# EAGLE design kurskTovideroRaspi (EAGLE 9.5.2)

## Sheet 1 of 4
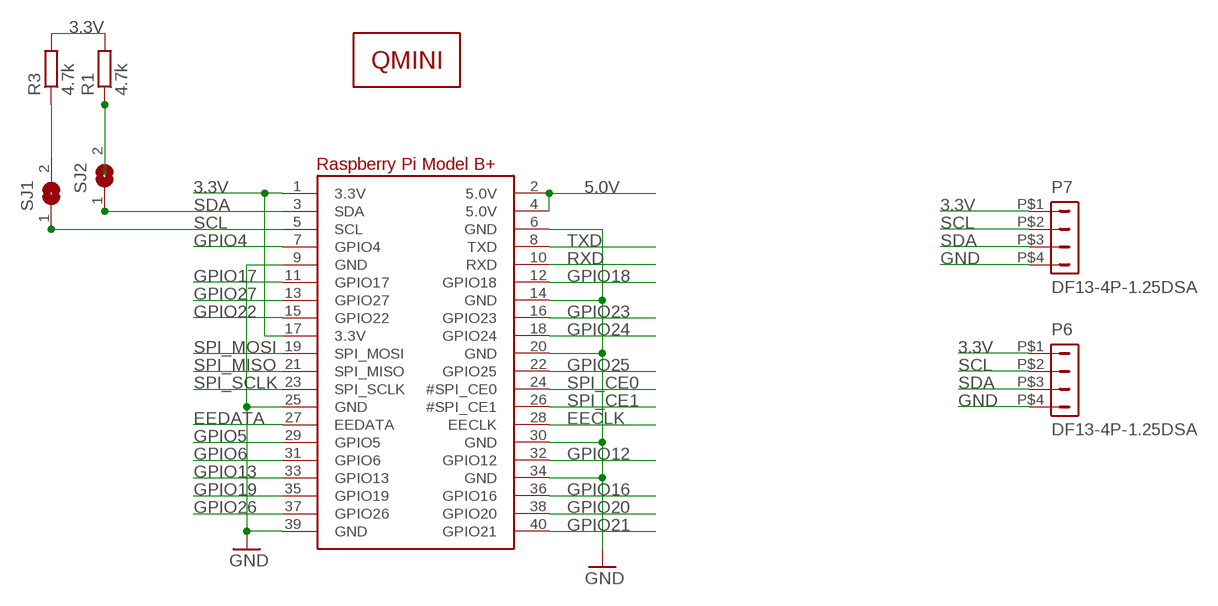
[diagram p0: schematic, sheet 1]

### Parts
P6  DF13-4P-1.25DSA  [DF13-4P-1.25DSA]
P7  DF13-4P-1.25DSA  [DF13-4P-1.25DSA]
R1  4.7k  R-EU_R0805  [R0805]
R3  4.7k  R-EU_R0805  [R0805]
RPI1  RASPBERRYPI_BPLUS_HATNOSLOTS  [PI_HAT_NOSLOTS]
SJ1  SJ  [SJ]
SJ2  SJ  [SJ]
U$1  QMINI  [QMINI]

### Nets
3.3V: P6.P$1 P7.P$1 R1.2 R3.2 RPI1.1(3.3V) RPI1.17(3.3V) ; also sheet 3,4
5.0V: RPI1.2(5.0V) RPI1.4(5.0V) ; also sheet 2
EECLK: RPI1.28(EECLK)
EEDATA: RPI1.27(EEDATA)
GND: P6.P$4 P7.P$4 RPI1.6(GND) RPI1.9(GND) RPI1.14(GND) RPI1.20(GND) RPI1.25(GND) RPI1.30(GND) RPI1.34(GND) RPI1.39(GND) ; also sheet 2,3,4
GPIO4: RPI1.7(GPIO4)
GPIO5: RPI1.29(GPIO5)
GPIO6: RPI1.31(GPIO6)
GPIO12: RPI1.32(GPIO12)
GPIO13: RPI1.33(GPIO13)
GPIO16: RPI1.36(GPIO16)
GPIO17: RPI1.11(GPIO17) ; also sheet 2
GPIO18: RPI1.12(GPIO18)
GPIO19: RPI1.35(GPIO19)
GPIO20: RPI1.38(GPIO20)
GPIO21: RPI1.40(GPIO21)
GPIO22: RPI1.15(GPIO22) ; also sheet 2
GPIO23: RPI1.16(GPIO23)
GPIO24: RPI1.18(GPIO24)
GPIO25: RPI1.22(GPIO25)
GPIO26: RPI1.37(GPIO26)
GPIO27: RPI1.13(GPIO27) ; also sheet 2
N$1: R3.1 SJ1.2
N$7: R1.1 SJ2.2
RXD: RPI1.10(RXD)
SCL: P6.P$2 P7.P$2 RPI1.5(SCL) SJ1.1 ; also sheet 3,4
SDA: P6.P$3 P7.P$3 RPI1.3(SDA) SJ2.1 ; also sheet 3,4
SPI_CE0: RPI1.24(#SPI_CE0)
SPI_CE1: RPI1.26(#SPI_CE1)
SPI_MISO: RPI1.21(SPI_MISO)
SPI_MOSI: RPI1.19(SPI_MOSI)
SPI_SCLK: RPI1.23(SPI_SCLK)
TXD: RPI1.8(TXD)

## Sheet 2 of 4
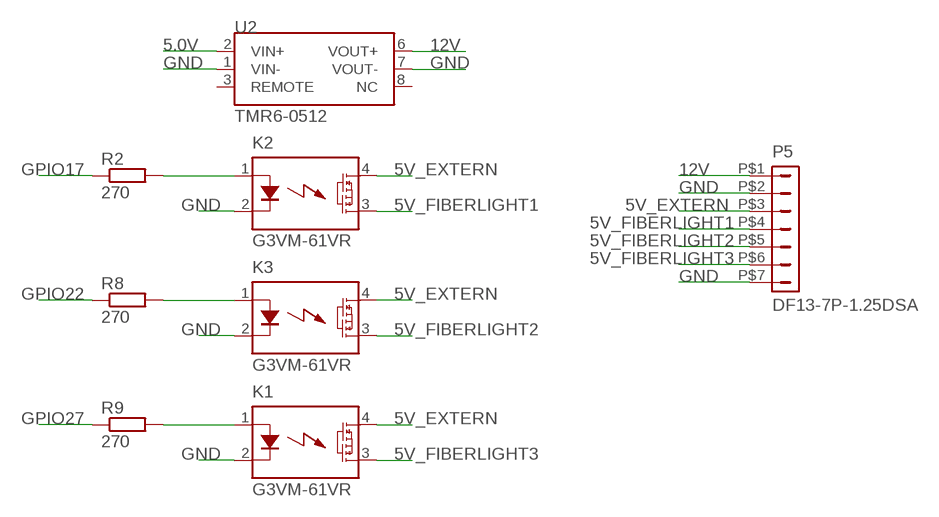
[diagram p1: schematic, sheet 2]

### Parts
K1  G3VM-61VR  AQY22SOP  [SOP04]
K2  G3VM-61VR  AQY22SOP  [SOP04]
K3  G3VM-61VR  AQY22SOP  [SOP04]
P5  DF13-7P-1.25DSA  [DF13-7P-1.25DSA]
R2  270  R-EU_R0805  [R0805]
R8  270  R-EU_R0805  [R0805]
R9  270  R-EU_R0805  [R0805]
U2  TMR6-0512  [TMR6-0512]

### Nets
5.0V: U2.2(VIN+) ; also sheet 1
5V_EXTERN: K1.4(DS1) K2.4(DS1) K3.4(DS1) P5.P$3
5V_FIBERLIGHT1: K2.3(DS2) P5.P$4
5V_FIBERLIGHT2: K3.3(DS2) P5.P$5
5V_FIBERLIGHT3: K1.3(DS2) P5.P$6
12V: P5.P$1 U2.6(VOUT+)
GND: K1.2(K) K2.2(K) K3.2(K) P5.P$2 P5.P$7 U2.1(VIN-) U2.7(VOUT-) ; also sheet 1,3,4
GPIO17: R2.1 ; also sheet 1
GPIO22: R8.1 ; also sheet 1
GPIO27: R9.1 ; also sheet 1
N$2: K1.1(A) R9.2
N$3: K2.1(A) R2.2
N$9: K3.1(A) R8.2
Unconnected: U2.3(REMOTE) U2.8(NC)

## Sheet 3 of 4
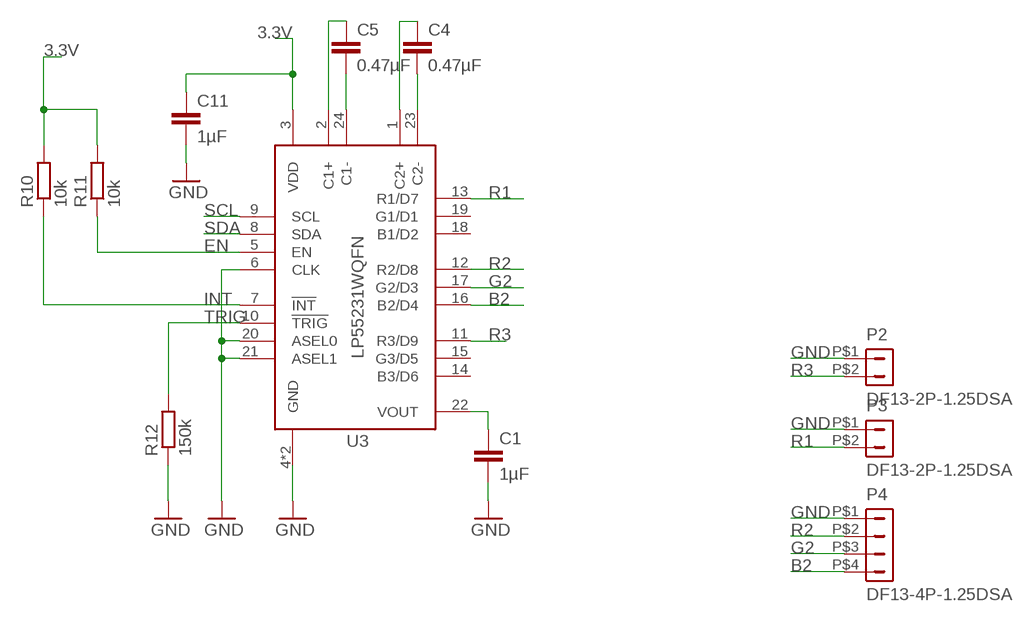
[diagram p2: schematic, sheet 3]

### Parts
C1  1µF  C-EUC0805  [C0805]
C4  0.47µF  C-EUC0805  [C0805]
C5  0.47µF  C-EUC0805  [C0805]
C11  1µF  C-EUC0805  [C0805]
P2  DF13-2P-1.25DSA  [DF13-2P-1.25DSA]
P3  DF13-2P-1.25DSA  [DF13-2P-1.25DSA]
P4  DF13-4P-1.25DSA  [DF13-4P-1.25DSA]
R10  10k  R-EU_R0805  [R0805]
R11  10k  R-EU_R0805  [R0805]
R12  150k  R-EU_R0805  [R0805]
U3  LP55231WQFN  [WQFN-24]

### Nets
3.3V: C11.1 R10.2 R11.2 U3.3(VDD) ; also sheet 1,4
B2: P4.P$4 U3.16(B2/D4)
EN: R11.1 U3.5(EN)
G2: P4.P$3 U3.17(G2/D3)
GND: C1.2 C11.2 P2.P$1 P3.P$1 P4.P$1 R12.1 U3.4(GND) U3.6(CLK) U3.20(ASEL0) U3.21(ASEL1) U3.EP(GND) ; also sheet 1,2,4
INT: R10.1 U3.7(!INT)
N$4: C5.2 U3.24(C1-)
N$5: C4.2 U3.23(C2-)
N$6: C4.1 U3.1(C2+)
N$11: C5.1 U3.2(C1+)
R1: P3.P$2 U3.13(R1/D7)
R2: P4.P$2 U3.12(R2/D8)
R3: P2.P$2 U3.11(R3/D9)
SCL: U3.9(SCL) ; also sheet 1,4
SDA: U3.8(SDA) ; also sheet 1,4
TRIG: R12.2 U3.10(!TRIG)
VOUT: C1.1 U3.22(VOUT)
Unconnected: U3.14(B3/D6) U3.15(G3/D5) U3.18(B1/D2) U3.19(G1/D1)

## Sheet 4 of 4
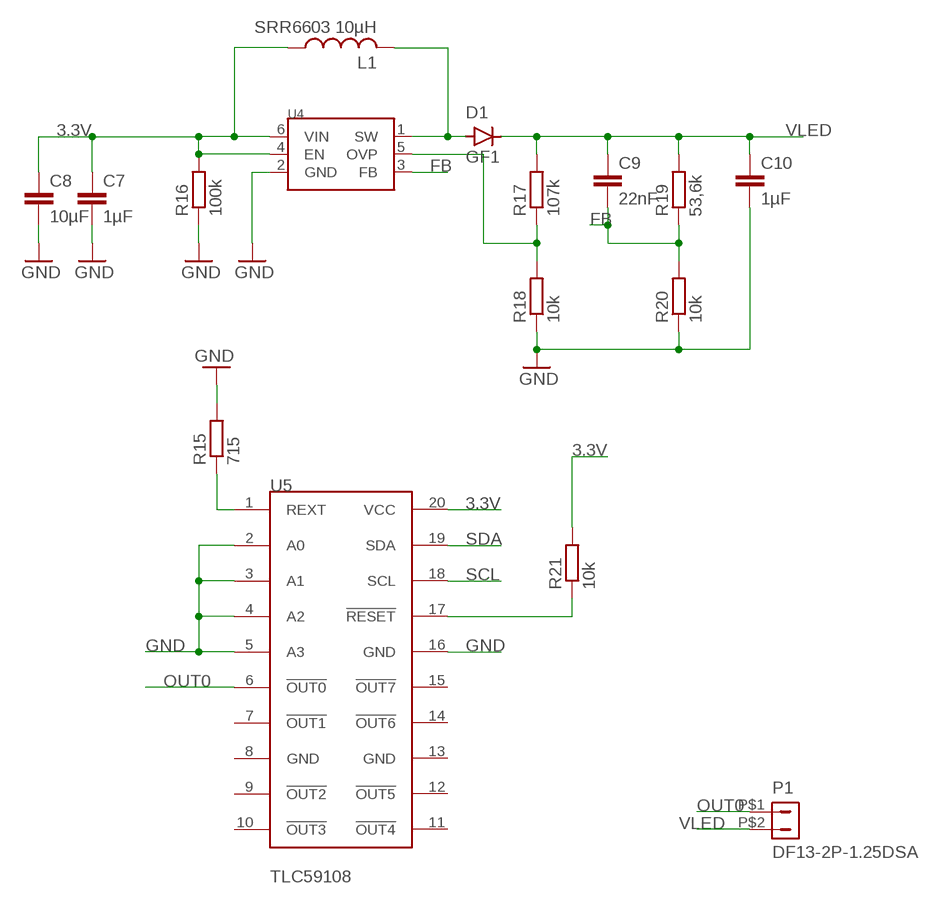
[diagram p3: schematic, sheet 4]

### Parts
C7  1µF  C-EUC0805  [C0805]
C8  10µF  C-EUC0805  [C0805]
C9  22nF  C-EUC0805  [C0805]
C10  1µF  C-EUC0805  [C0805]
D1  GF1  [SMA-DO214AC]
L1  SRR6603 10µH  SRR6603  [SRR6603]
P1  DF13-2P-1.25DSA  [DF13-2P-1.25DSA]
R15  715  R-EU_R0805  [R0805]
R16  100k  R-EU_R0805  [R0805]
R17  107k  R-EU_R0805  [R0805]
R18  10k  R-EU_R0805  [R0805]
R19  53,6k  R-EU_R0805  [R0805]
R20  10k  R-EU_R0805  [R0805]
R21  10k  R-EU_R0805  [R0805]
U4  MIC2619  [SOT-23-6]
U5  TLC59108  [TSSOP20]

### Nets
3.3V: C7.1 C8.1 L1.1 R16.2 R21.2 U4.4(EN) U4.6(VIN) U5.20(VCC) ; also sheet 1,3
FB: C9.2 R19.1 R20.2 U4.3(FB)
GND: C7.2 C8.2 C10.2 R15.2 R16.1 R18.1 R20.1 U4.2(GND) U5.2(A0) U5.3(A1) U5.4(A2) U5.5(A3) U5.16(GND) ; also sheet 1,2,3
N$13: R15.1 U5.1(REXT)
N$15: D1.A L1.2 U4.1(SW)
N$16: R17.1 R18.2 U4.5(OVP)
N$17: R21.1 U5.17(!RESET)
OUT0: P1.P$1 U5.6(!OUT0)
SCL: U5.18(SCL) ; also sheet 1,3
SDA: U5.19(SDA) ; also sheet 1,3
VLED: C9.1 C10.1 D1.K(C) P1.P$2 R17.2 R19.2
Unconnected: U5.7(!OUT1) U5.8(GND) U5.9(!OUT2) U5.10(!OUT3) U5.11(!OUT4) U5.12(!OUT5) U5.13(GND) U5.14(!OUT6) U5.15(!OUT7)

## Library data of the parts
C1 C7 C10 C11 = rcl:C-EU: CAPACITOR, European symbol; CLASS: CAPACITOR; DESCRIPTION: NO DESCRIPTION; DIGIKEY: 311-1458-1-ND; LINK: UNKNOWN LINK; MANUFACTURER: UNKNOWN MANUFACTURER; MANUFACTURERPARTNUMBER: UNKNOWN MANUFACTURER PART NUMBER; MF: AVX; MPN: 08053C105JAT2A; OC_FARNELL: 2332736; POPULATED: TRUE; ROHSCERTIFICATE: UNKNOWN ROHS CERTIFICATE; SOURCE: UNKNOWN SOURCE; SOURCEPARTNUMBER: UNKNOWN SOURCE PART NUMBER; SPICEPREFIX: C
C4 C5 = rcl:C-EU: CAPACITOR, European symbol; CLASS: CAPACITOR; DESCRIPTION: NO DESCRIPTION; DIGIKEY: 399-9247-1-ND; LINK: UNKNOWN LINK; MANUFACTURER: UNKNOWN MANUFACTURER; MANUFACTURERPARTNUMBER: UNKNOWN MANUFACTURER PART NUMBER; MF: VISHAY; MPN: VJ0805Y474JXQTW1BC; OC_FARNELL: 2896589; POPULATED: TRUE; ROHSCERTIFICATE: UNKNOWN ROHS CERTIFICATE; SOURCE: UNKNOWN SOURCE; SOURCEPARTNUMBER: UNKNOWN SOURCE PART NUMBER; SPICEPREFIX: C
C8 = rcl:C-EU: CAPACITOR, European symbol; CLASS: CAPACITOR; DESCRIPTION: NO DESCRIPTION; DIGIKEY: 399-4925-1-ND; LINK: UNKNOWN LINK; MANUFACTURER: UNKNOWN MANUFACTURER; MANUFACTURERPARTNUMBER: UNKNOWN MANUFACTURER PART NUMBER; MF: KEMET; MPN: C0805C106K8RACTU; OC_FARNELL: 2118132; POPULATED: TRUE; ROHSCERTIFICATE: UNKNOWN ROHS CERTIFICATE; SOURCE: UNKNOWN SOURCE; SOURCEPARTNUMBER: UNKNOWN SOURCE PART NUMBER; SPICEPREFIX: C
C9 = rcl:C-EU: CAPACITOR, European symbol; CLASS: CAPACITOR; DESCRIPTION: NO DESCRIPTION; DIGIKEY: 732-8023-1-ND; LINK: UNKNOWN LINK; MANUFACTURER: UNKNOWN MANUFACTURER; MANUFACTURERPARTNUMBER: UNKNOWN MANUFACTURER PART NUMBER; MF: AVX; MPN: 08055C223KAZ2A; OC_FARNELL: 1740538; POPULATED: TRUE; ROHSCERTIFICATE: UNKNOWN ROHS CERTIFICATE; SOURCE: UNKNOWN SOURCE; SOURCEPARTNUMBER: UNKNOWN SOURCE PART NUMBER; SPICEPREFIX: C
D1 = diode:GF1: DIODE; CLASS: DIODE; DESCRIPTION: NO DESCRIPTION; DIGIKEY: EGF1D-E3/67AGICT-ND; LINK: UNKNOWN LINK; MANUFACTURER: UNKNOWN MANUFACTURER; MANUFACTURERPARTNUMBER: UNKNOWN MANUFACTURER PART NUMBER; MF: VISHAY; MPN: EGF1D-E3/67A; OC_FARNELL: 1836975; POPULATED: TRUE; ROHSCERTIFICATE: UNKNOWN ROHS CERTIFICATE; SOURCE: UNKNOWN SOURCE; SOURCEPARTNUMBER: UNKNOWN SOURCE PART NUMBER
K1-K3 = relay:AQY*: PhotoMOS Relay NAiS Source: http://www.panasonic-electric-works.com/catalogues/downloads/photomos/ds_x615_en_aqz10_20.pdf; CLASS: RELAY; DESCRIPTION: NO DESCRIPTION; DIGIKEY: Z10319CT-ND; LINK: UNKNOWN LINK; MANUFACTURER: UNKNOWN MANUFACTURER; MANUFACTURERPARTNUMBER: UNKNOWN MANUFACTURER PART NUMBER; MF: OMRON; MPN: G3VM-61VR(TR05); OC_FARNELL: 2889501; OC_NEWARK: unknown; POPULATED: TRUE; ROHSCERTIFICATE: UNKNOWN ROHS CERTIFICATE; SOURCE: UNKNOWN SOURCE; SOURCEPARTNUMBER: UNKNOWN SOURCE PART NUMBER
L1 = detector:SRR6603; CLASS: INDUCTOR; DESCRIPTION: NO DESCRIPTION; DIGIKEY: SRR6603-100MLCT-ND; LINK: UNKNOWN LINK; MANUFACTURER: UNKNOWN MANUFACTURER; MANUFACTURERPARTNUMBER: UNKNOWN MANUFACTURER PART NUMBER; MF: BOURNS; MPN: SRR6603-100ML; OC_FARNELL: 2333822; POPULATED: TRUE; ROHSCERTIFICATE: UNKNOWN ROHS CERTIFICATE; SOURCE: UNKNOWN SOURCE; SOURCEPARTNUMBER: UNKNOWN SOURCE PART NUMBER
P1-P3 = con-hirose-df13:DF13-2P-1.25: DF13-2P 1.25mm Pitch Miniature Crimping Connector.; CLASS: UNKNOWN CLASS; DESCRIPTION: NO DESCRIPTION; DIGIKEY: H2191-ND; LINK: UNKNOWN LINK; MANUFACTURER: UNKNOWN MANUFACTURER; MANUFACTURERPARTNUMBER: UNKNOWN MANUFACTURER PART NUMBER; MF: HIROSE(HRS); MPN: DF13-2P-1.25DSA; OC_FARNELL: 2427585; POPULATED: TRUE; ROHSCERTIFICATE: UNKNOWN ROHS CERTIFICATE; SOURCE: UNKNOWN SOURCE; SOURCEPARTNUMBER: UNKNOWN SOURCE PART NUMBER
P4 P6 = con-hirose-df13:DF13-4P-1.25: DF13-4P 1.25mm Pitch Miniature Crimping Connector.; CLASS: UNKNOWN CLASS; DESCRIPTION: NO DESCRIPTION; DIGIKEY: H2193-ND; LINK: UNKNOWN LINK; MANUFACTURER: UNKNOWN MANUFACTURER; MANUFACTURERPARTNUMBER: UNKNOWN MANUFACTURER PART NUMBER; MF: HIROSE(HRS); MPN: DF13-4P-1.25DSA; OC_FARNELL: 2427588; POPULATED: TRUE; ROHSCERTIFICATE: UNKNOWN ROHS CERTIFICATE; SOURCE: UNKNOWN SOURCE; SOURCEPARTNUMBER: UNKNOWN SOURCE PART NUMBER
P5 = con-hirose-df13:DF13-7P-1.25: DF13-7P 1.25mm Pitch Miniature Crimping Connector.; CLASS: UNKNOWN CLASS; DESCRIPTION: NO DESCRIPTION; DIGIKEY: H2196-ND; LINK: UNKNOWN LINK; MANUFACTURER: UNKNOWN MANUFACTURER; MANUFACTURERPARTNUMBER: UNKNOWN MANUFACTURER PART NUMBER; MF: HIROSE(HRS); MPN: DF13A-7P-1.25H(21); OC_FARNELL: 3019730; POPULATED: TRUE; ROHSCERTIFICATE: UNKNOWN ROHS CERTIFICATE; SOURCE: UNKNOWN SOURCE; SOURCEPARTNUMBER: UNKNOWN SOURCE PART NUMBER
P7 = con-hirose-df13:DF13-4P-1.25: DF13-4P 1.25mm Pitch Miniature Crimping Connector.; CLASS: UNKNOWN CLASS; DESCRIPTION: NO DESCRIPTION; DIGIKEY#: H2193-ND; LINK: UNKNOWN LINK; MANUFACTURER: UNKNOWN MANUFACTURER; MANUFACTURERPARTNUMBER: UNKNOWN MANUFACTURER PART NUMBER; MF: HIROSE(HRS); MPN: DF13-4P-1.25DSA; OC_FARNELL: 2427588; POPULATED: TRUE; ROHSCERTIFICATE: UNKNOWN ROHS CERTIFICATE; SOURCE: UNKNOWN SOURCE; SOURCEPARTNUMBER: UNKNOWN SOURCE PART NUMBER
R1 R3 = rcl:R-EU_: RESISTOR, European symbol; CLASS: RESISTOR; DESCRIPTION: NO DESCRIPTION; DIGIKEY: 541-4.70KCCT-ND; LINK: UNKNOWN LINK; MANUFACTURER: UNKNOWN MANUFACTURER; MANUFACTURERPARTNUMBER: UNKNOWN MANUFACTURER PART NUMBER; MF: YAGEO; MPN: RE0805DR-074K7L; OC_FARNELL: 1840620; POPULATED: TRUE; ROHSCERTIFICATE: UNKNOWN ROHS CERTIFICATE; SOURCE: UNKNOWN SOURCE; SOURCEPARTNUMBER: UNKNOWN SOURCE PART NUMBER; SPICEPREFIX: R
R2 R8 R9 = rcl:R-EU_: RESISTOR, European symbol; CLASS: RESISTOR; DESCRIPTION: NO DESCRIPTION; DIGIKEY: P270CCT-ND; LINK: UNKNOWN LINK; MANUFACTURER: UNKNOWN MANUFACTURER; MANUFACTURERPARTNUMBER: UNKNOWN MANUFACTURER PART NUMBER; MF: PANASONIC; MPN: ERA6AEB271V; OC_FARNELL: 1577650; POPULATED: TRUE; ROHSCERTIFICATE: UNKNOWN ROHS CERTIFICATE; SOURCE: UNKNOWN SOURCE; SOURCEPARTNUMBER: UNKNOWN SOURCE PART NUMBER; SPICEPREFIX: R
R10 R11 R18 R20 R21 = rcl:R-EU_: RESISTOR, European symbol; CLASS: RESISTOR; DESCRIPTION: NO DESCRIPTION; DIGIKEY: 311-10.0KCRCT-ND; LINK: UNKNOWN LINK; MANUFACTURER: UNKNOWN MANUFACTURER; MANUFACTURERPARTNUMBER: UNKNOWN MANUFACTURER PART NUMBER; OC_FARNELL: unknown; POPULATED: TRUE; ROHSCERTIFICATE: UNKNOWN ROHS CERTIFICATE; SOURCE: UNKNOWN SOURCE; SOURCEPARTNUMBER: UNKNOWN SOURCE PART NUMBER; SPICEPREFIX: R
R12 = rcl:R-EU_: RESISTOR, European symbol; CLASS: RESISTOR; DESCRIPTION: NO DESCRIPTION; DIGIKEY: P150KCCT-ND; LINK: UNKNOWN LINK; MANUFACTURER: UNKNOWN MANUFACTURER; MANUFACTURERPARTNUMBER: UNKNOWN MANUFACTURER PART NUMBER; MF: MULTICOMP PRO; MPN: MCWR08X1503FTL; OC_FARNELL: 2447573; POPULATED: TRUE; ROHSCERTIFICATE: UNKNOWN ROHS CERTIFICATE; SOURCE: UNKNOWN SOURCE; SOURCEPARTNUMBER: UNKNOWN SOURCE PART NUMBER; SPICEPREFIX: R
R15 = rcl:R-EU_: RESISTOR, European symbol; CLASS: RESISTOR; DESCRIPTION: NO DESCRIPTION; DIGIKEY: RMCF0805FT715RCT-ND; LINK: UNKNOWN LINK; MANUFACTURER: UNKNOWN MANUFACTURER; MANUFACTURERPARTNUMBER: UNKNOWN MANUFACTURER PART NUMBER; MF: PANASONIC; MPN: ERJ6ENF7150V; OC_FARNELL: 2303536; POPULATED: TRUE; ROHSCERTIFICATE: UNKNOWN ROHS CERTIFICATE; SOURCE: UNKNOWN SOURCE; SOURCEPARTNUMBER: UNKNOWN SOURCE PART NUMBER; SPICEPREFIX: R
R16 = rcl:R-EU_: RESISTOR, European symbol; CLASS: RESISTOR; DESCRIPTION: NO DESCRIPTION; DIGIKEY: 311-100KCRCT-ND; LINK: UNKNOWN LINK; MANUFACTURER: UNKNOWN MANUFACTURER; MANUFACTURERPARTNUMBER: UNKNOWN MANUFACTURER PART NUMBER; MF: PANASONIC; MPN: ERJT06J104V; OC_FARNELL: 1618243; POPULATED: TRUE; ROHSCERTIFICATE: UNKNOWN ROHS CERTIFICATE; SOURCE: UNKNOWN SOURCE; SOURCEPARTNUMBER: UNKNOWN SOURCE PART NUMBER; SPICEPREFIX: R
R17 = rcl:R-EU_: RESISTOR, European symbol; CLASS: RESISTOR; DESCRIPTION: NO DESCRIPTION; DIGIKEY: 541-107KCCT-ND; LINK: UNKNOWN LINK; MANUFACTURER: UNKNOWN MANUFACTURER; MANUFACTURERPARTNUMBER: UNKNOWN MANUFACTURER PART NUMBER; MF: VISHAY; MPN: CRCW0805107KFKEA; OC_FARNELL: 2316483; POPULATED: TRUE; ROHSCERTIFICATE: UNKNOWN ROHS CERTIFICATE; SOURCE: UNKNOWN SOURCE; SOURCEPARTNUMBER: UNKNOWN SOURCE PART NUMBER; SPICEPREFIX: R
R19 = rcl:R-EU_: RESISTOR, European symbol; CLASS: RESISTOR; DESCRIPTION: NO DESCRIPTION; DIGIKEY: P53.6KFCT-ND; LINK: UNKNOWN LINK; MANUFACTURER: UNKNOWN MANUFACTURER; MANUFACTURERPARTNUMBER: UNKNOWN MANUFACTURER PART NUMBER; MF: MULTICOMP PRO; MPN: MCWR08X5362FTL; OC_FARNELL: 2447683; POPULATED: TRUE; ROHSCERTIFICATE: UNKNOWN ROHS CERTIFICATE; SOURCE: UNKNOWN SOURCE; SOURCEPARTNUMBER: UNKNOWN SOURCE PART NUMBER; SPICEPREFIX: R
RPI1 = microbuilder:RASPBERRYPI_BPLUS; CLASS: RESISTOR; DESCRIPTION: NO DESCRIPTION; LINK: UNKNOWN LINK; MANUFACTURER: UNKNOWN MANUFACTURER; MANUFACTURERPARTNUMBER: UNKNOWN MANUFACTURER PART NUMBER; OC_FARNELL: unknown; POPULATED: TRUE; ROHSCERTIFICATE: UNKNOWN ROHS CERTIFICATE; SOURCE: UNKNOWN SOURCE; SOURCEPARTNUMBER: UNKNOWN SOURCE PART NUMBER
SJ1 SJ2 = jumper:SJ: SMD solder JUMPER; OC_FARNELL: unknown
U2 = dcdc:TMR6-0512; CLASS: IC; DESCRIPTION: NO DESCRIPTION; DIGIKEY: 1951-2391-ND; LINK: UNKNOWN LINK; MANUFACTURER: UNKNOWN MANUFACTURER; MANUFACTURERPARTNUMBER: UNKNOWN MANUFACTURER PART NUMBER; MF: TRACOPOWER; MPN: TMR 6-0512; OC_FARNELL: 2280181; POPULATED: TRUE; ROHSCERTIFICATE: UNKNOWN ROHS CERTIFICATE; SOURCE: UNKNOWN SOURCE; SOURCEPARTNUMBER: UNKNOWN SOURCE PART NUMBER
U3 = LP55231:LP55231; CLASS: IC; DESCRIPTION: NO DESCRIPTION; DIGIKEY: 296-40354-1-ND; LINK: UNKNOWN LINK; MANUFACTURER: UNKNOWN MANUFACTURER; MANUFACTURERPARTNUMBER: UNKNOWN MANUFACTURER PART NUMBER; MF: TEXAS INSTRUMENTS; MPN: LP55231SQE/NOPB; OC_FARNELL: 3006014; POPULATED: TRUE; PROD_ID: IC-13302; ROHSCERTIFICATE: UNKNOWN ROHS CERTIFICATE; SOURCE: UNKNOWN SOURCE; SOURCEPARTNUMBER: UNKNOWN SOURCE PART NUMBER
U4 = emitter:MIC2619; CLASS: IC; DESCRIPTION: NO DESCRIPTION; DIGIKEY: 576-3655-1-ND; LINK: UNKNOWN LINK; MANUFACTURER: UNKNOWN MANUFACTURER; MANUFACTURERPARTNUMBER: UNKNOWN MANUFACTURER PART NUMBER; MF: MICROCHIP; MPN: MIC2619YD6-TR; OC_FARNELL: 2509963; POPULATED: TRUE; ROHSCERTIFICATE: UNKNOWN ROHS CERTIFICATE; SOURCE: UNKNOWN SOURCE; SOURCEPARTNUMBER: UNKNOWN SOURCE PART NUMBER
U5 = emitter:TLC59108: 8-Bit Fast Mode Plus (FM+) I2C Bus Constant-Current LED Sink Driver; CLASS: IC; DESCRIPTION: NO DESCRIPTION; DIGIKEY: 296-25340-1-ND; LINK: UNKNOWN LINK; MANUFACTURER: UNKNOWN MANUFACTURER; MANUFACTURERPARTNUMBER: UNKNOWN MANUFACTURER PART NUMBER; MF: TEXAS INSTRUMENTS; MPN: TLC59108IPWR; OC_FARNELL: 3119168; POPULATED: TRUE; ROHSCERTIFICATE: UNKNOWN ROHS CERTIFICATE; SOURCE: UNKNOWN SOURCE; SOURCEPARTNUMBER: UNKNOWN SOURCE PART NUMBER
U$1 = Peripherie:QMINI; CLASS: IC; DESCRIPTION: NO DESCRIPTION; LINK: UNKNOWN LINK; MANUFACTURER: UNKNOWN MANUFACTURER; MANUFACTURERPARTNUMBER: UNKNOWN MANUFACTURER PART NUMBER; OC_FARNELL: unknown; POPULATED: TRUE; ROHSCERTIFICATE: UNKNOWN ROHS CERTIFICATE; SOURCE: UNKNOWN SOURCE; SOURCEPARTNUMBER: UNKNOWN SOURCE PART NUMBER

## Board
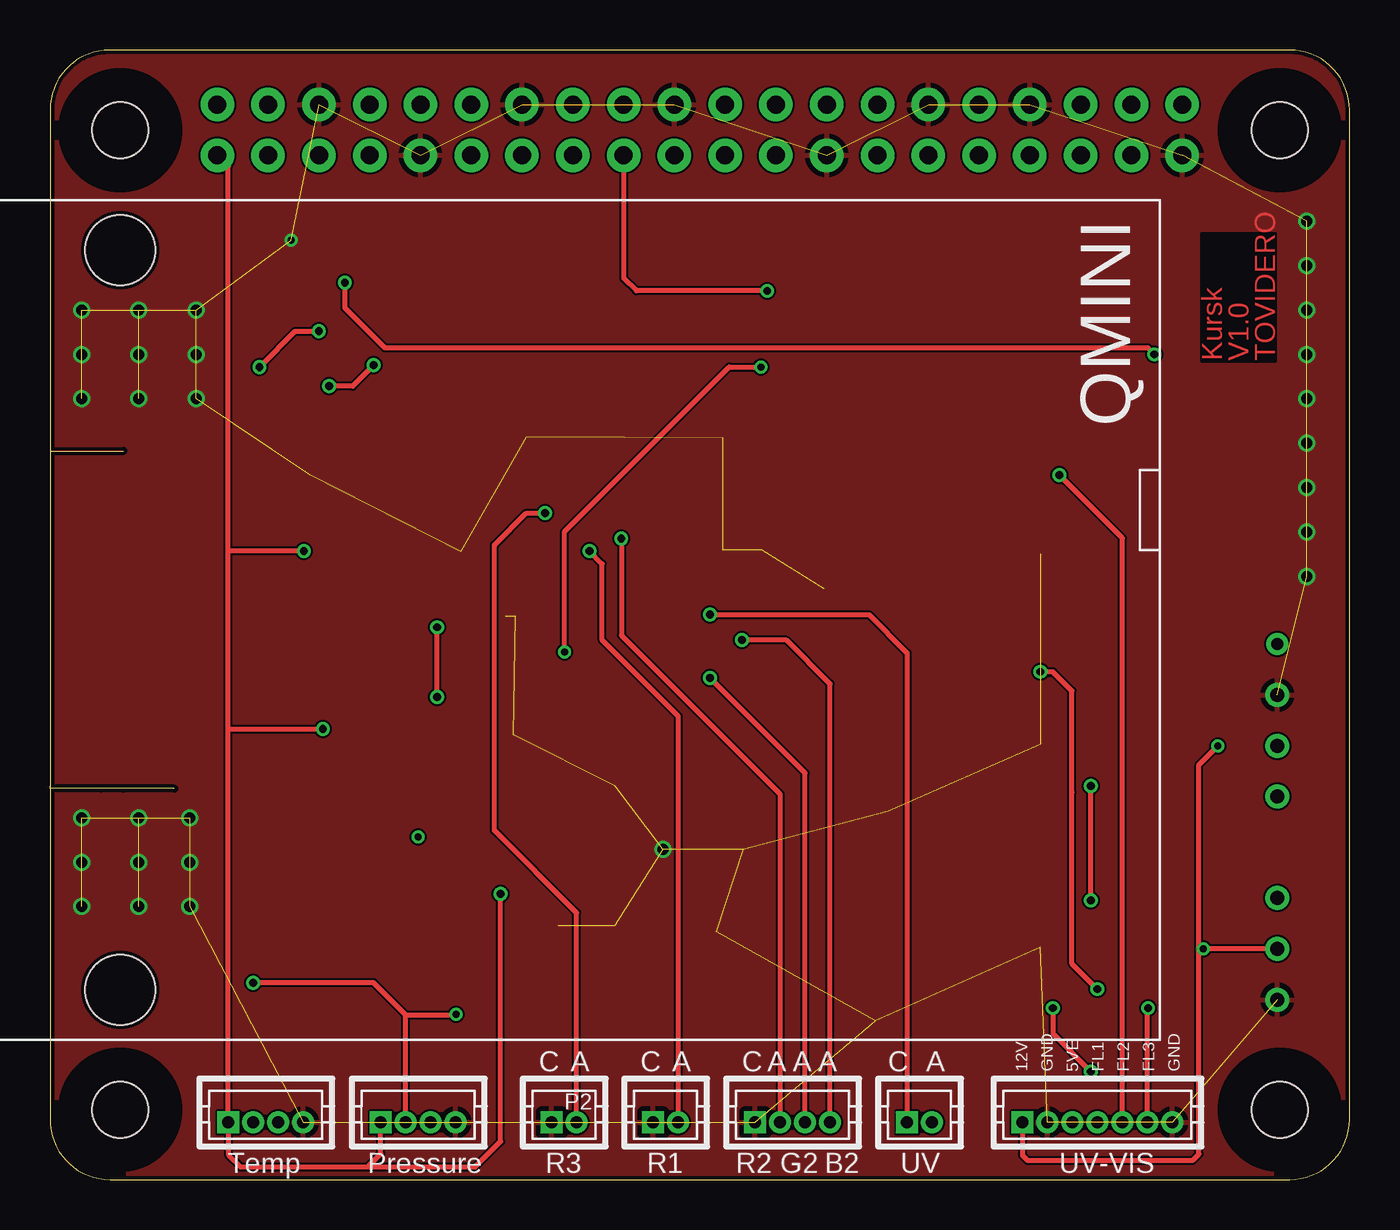
[diagram p4: board, top side]
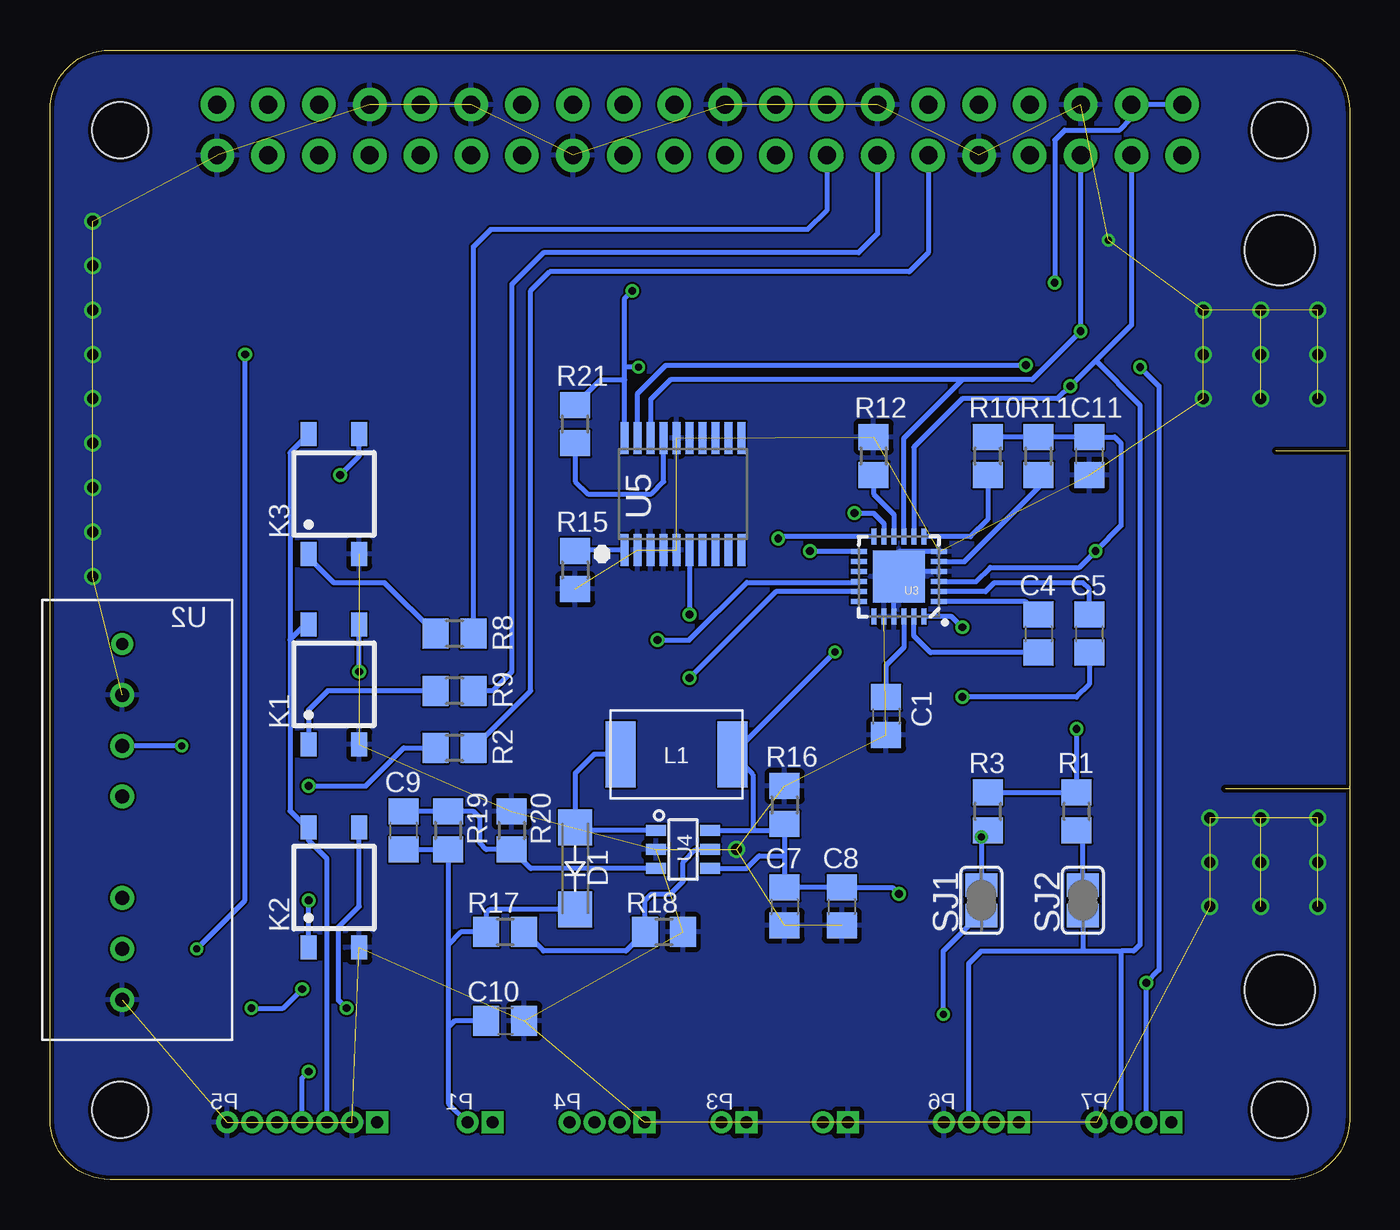
[diagram p5: board, bottom side, seen from below]

Size 65 x 56.5 mm. Coordinates in mm from the lower left corner, seen from the top.
Outline: 0,36.45 3.68,36.45
Outline: 3.68,19.56 0,19.56 0,19.68
Outline: 6.22,19.56 2.54,19.56
Copper layers (1*16): Top 0.035mm / dielectric 1.5mm / Bottom 0.035mm
Design rules "aisler_2_layer": minimum track width 0.1mm, minimum drill 0.2mm, track to track 0.1mm, track to pad 0.1mm, pad to pad 0.1mm, via to via 0.1mm, smd to smd 0.1mm, copper to edge 0.2mm, drill to drill 0.21mm, minimum pad ring 0.25mm, minimum via ring 0.15mm, stop-mask expansion 0mil, vias tented up to drill 0mil, thermal gap 10mil

### Footprints (pad centres in the part's own frame; a part is rotated, then mirrored left to right if it is on the bottom)
C0805 = smd 1.3 x 1.5: 1 -0.95,0; 2 0.95,0
SMA-DO214AC = smd 1.8 x 1.7: A -2.05,0; K 2.05,0
SOP04 = smd 0.8 x 1.2: 1 -1.27,-3; 2 1.27,-3; 3 1.27,3; 4 -1.27,3
SRR6603 = smd 1.5 x 3.3: 1 -2.8,0; 2 2.8,0
DF13-2P-1.25DSA = drill 0.6 pad 1.016 square: P$1 0.625,0 | drill 0.6 pad 1.016: P$2 -0.625,0
DF13-4P-1.25DSA = drill 0.6 pad 1.016 square: P$1 1.875,0 | drill 0.6 pad 1.016: P$2 0.625,0; P$3 -0.625,0; P$4 -1.875,0
DF13-7P-1.25DSA = drill 0.6 pad 1.016 square: P$1 3.75,0 | drill 0.6 pad 1.016: P$2 2.5,0; P$3 1.25,0; P$4 0,0; P$5 -1.25,0; P$6 -2.5,0; P$7 -3.75,0
R0805 = smd 1.3 x 1.5: 1 -0.95,0; 2 0.95,0
PI_HAT_NOSLOTS = drill 0.9 pad 1.676: 1 8.37,51.23; 2 8.37,53.77; 3 10.91,51.23; 4 10.91,53.77; 5 13.45,51.23; 6 13.45,53.77; 7 15.99,51.23; 8 15.99,53.77; 9 18.53,51.23; 10 18.53,53.77; 11 21.07,51.23; 12 21.07,53.77; 13 23.61,51.23; 14 23.61,53.77; 15 26.15,51.23; 16 26.15,53.77; 17 28.69,51.23; 18 28.69,53.77; 19 31.23,51.23; 20 31.23,53.77; 21 33.77,51.23; 22 33.77,53.77; 23 36.31,51.23; 24 36.31,53.77; 25 38.85,51.23; 26 38.85,53.77; 27 41.39,51.23; 28 41.39,53.77; 29 43.93,51.23; 30 43.93,53.77; 31 46.47,51.23; 32 46.47,53.77; 33 49.01,51.23; 34 49.01,53.77; 35 51.55,51.23; 36 51.55,53.77; 37 54.09,51.23; 38 54.09,53.77; 39 56.63,51.23; 40 56.63,53.77 | hole 2.8: 3.5,3.5; 3.5,52.5; 61.5,52.5; 61.5,3.5
SJ = smd 1.168 x 1.6: 1 -0.762,0; 2 0.762,0
TMR6-0512 = drill 0.7: 1 -9,0; 2 -6.46,0; 3 -3.92,0; 5 1.16,0; 6 3.7,0; 7 6.24,0 | drill 0.6: 8 8.78,0
WQFN-24 = smd 0.8 x 0.25: 1 -2,1.25; 2 -2,0.75; 3 -2,0.25; 4 -2,-0.25; 5 -2,-0.75; 6 -2,-1.25; 13 2,-1.25; 14 2,-0.75; 15 2,-0.25; 16 2,0.25; 17 2,0.75; 18 2,1.25 | smd 0.25 x 0.8: 7 -1.25,-2; 8 -0.75,-2; 9 -0.25,-2; 10 0.25,-2; 11 0.75,-2; 12 1.25,-2; 19 1.25,2; 20 0.75,2; 21 0.25,2; 22 -0.25,2; 23 -0.75,2; 24 -1.25,2 | smd 2.6 x 2.6: EP 0,0
SOT-23-6 = smd 1 x 0.55: 1 -1.35,0.95; 2 -1.35,0; 3 -1.35,-0.95; 4 1.35,-0.95; 5 1.35,0; 6 1.35,0.95
TSSOP20 = smd 0.4 x 1.6: 1 -2.925,-2.8; 2 -2.275,-2.8; 3 -1.625,-2.8; 4 -0.975,-2.8; 5 -0.325,-2.8; 6 0.325,-2.8; 7 0.975,-2.8; 8 1.625,-2.8; 9 2.275,-2.8; 10 2.925,-2.8; 11 2.925,2.8; 12 2.275,2.8; 13 1.625,2.8; 14 0.975,2.8; 15 0.325,2.8; 16 -0.325,2.8; 17 -0.975,2.8; 18 -1.625,2.8; 19 -2.275,2.8; 20 -2.925,2.8
QMINI = hole 3.5: 2.5,12; 39.5,12

### Placement (x,y rotation side)
C1  23.18,23.18 270 bottom
C4  15.56,27.3 270 bottom
C5  13.02,27.3 270 bottom
C7  28.26,13.65 270 bottom
C8  25.4,13.65 270 bottom
C9  47.31,17.46 90 bottom
C10  42.23,7.94 0 bottom
C11  13.02,36.2 270 bottom
D1  38.73,15.56 270 bottom
K1  50.8,24.77 0 bottom
K2  50.8,14.61 0 bottom
K3  50.8,34.29 0 bottom
L1  33.66,21.27 180 bottom
P1  43.5,2.86 180 top
P2  25.72,2.86 180 top
P3  30.8,2.86 180 top
P4  37.15,2.86 180 top
P5  52.39,2.86 180 top
P6  18.41,2.86 180 top
P7  10.79,2.86 180 top
R1  13.65,18.41 90 bottom
R2  44.77,21.59 180 bottom
R3  18.1,18.41 90 bottom
R8  44.77,27.3 180 bottom
R9  44.77,24.45 180 bottom
R10  18.1,36.2 90 bottom
R11  15.56,36.2 90 bottom
R12  23.81,36.2 270 bottom
R15  38.73,30.48 270 bottom
R16  28.26,18.73 270 bottom
R17  42.23,12.38 180 bottom
R18  34.29,12.38 180 bottom
R19  45.09,17.46 270 bottom
R20  41.91,17.46 270 bottom
R21  38.73,37.78 90 bottom
RPI1  0,0 0 top
SJ1  18.41,13.97 90 bottom
SJ2  13.34,13.97 90 bottom
U2  61.38,18 90 bottom
U3  22.54,30.16 180 bottom
U4  33.34,16.51 0 bottom
U5  33.34,34.29 0 bottom
U$1  -8.5,49 270 top

### Tracks (layer width: path | path; a pad name or v marks a point on that pad's centre or on a via)
3.3V  (via drill 0.35, 0.39)
  Top 0.254: 15.88,0.64 9.53,0.64 8.92,1.24 P7.P$1 8.92,22.54 | 15.88,0.64 16.54,1.3 P6.P$1 | 8.92,22.54 8.92,31.43 | 8.92,31.43 8.92,50.68 RPI1.1 | RPI1.17 28.69,45.09 29.32,44.45 v35.88,44.45 | 8.92,22.54 v13.65,22.54 | v12.7,31.43 8.92,31.43 | 15.88,0.64 21.27,0.64 22.54,1.91 v22.54,14.29 | v25.75,26.38 25.75,32.41 33.97,40.64 v35.56,40.64
  Bottom 0.254: U4.6 29.84,17.46 | 29.84,17.46 28.58,17.46 R16.2 28.26,16.19 | 29.84,17.46 29.84,20.26 L1.1 v25.75,26.38 | U5.20 36.26,40.01 | R21.2 37.46,40.01 36.26,40.01 | v13.65,22.54 R1.2 R3.2 | U3.3 18.68,29.91 17.97,30.62 13.51,30.62 v12.7,31.43 11.43,32.7 11.43,36.83 11.74,37.15 C11.1 R11.2 R10.2 | v35.88,44.45 36.26,44.06 36.26,40.64 | 36.26,40.01 36.26,40.64 | v35.56,40.64 36.26,40.64 | v22.54,14.29 22.86,14.6 C8.1 C7.1 28.26,16.19 | U4.4 30.16,15.56 29.53,16.19 28.26,16.19
5.0V  (via drill 0.35, 0.39)
  Top 0.254: U2.2 v57.67,11.54 | v55.24,41.27 54.93,41.59 16.75,41.59 14.75,43.59 v14.75,44.86
  Bottom 0.254: v14.75,44.86 14.75,52 14.25,52.5 11.5,52.5 10.91,53.09 RPI1.4 RPI1.2 | v55.24,41.27 55.24,13.97 v57.67,11.54
5V_EXTERN
  Bottom 0.254: K1.4 52.24,27.77 53,27.01 | 53,27.01 53,18.44 52.17,17.61 K2.4 52.07,16.97 51.14,16.04 P5.P$3 | K3.4 53,36.36 53,27.01
5V_FIBERLIGHT1  (via drill 0.39)
  Top 0.254: v50.16,8.57 50.16,7.3 v52.07,5.4
  Bottom 0.254: P5.P$4 52.39,5.08 v52.07,5.4 | v50.16,8.57 50.58,8.98 50.58,12.61 49.53,13.65 K2.3
5V_FIBERLIGHT2  (via drill 0.39)
  Top 0.254: P5.P$5 53.64,32.09 v50.48,35.24
  Bottom 0.254: v50.48,35.24 49.53,36.2 K3.3
5V_FIBERLIGHT3  (via drill 0.39)
  Top 0.254: P5.P$6 54.89,8.53 v54.93,8.57 | v52.39,9.53 51.12,10.79 51.12,19.37 51.12,24.45 50.16,25.4 v49.53,25.4
  Bottom 0.254: v49.53,25.4 K1.3 | v54.93,8.57 53.34,8.57 v52.39,9.53
12V  (via drill 0.35)
  Top 0.254: P5.P$1 48.64,1.21 48.9,0.95 57.15,0.95 57.47,1.27 57.47,20.75 v58.42,21.7
  Bottom 0.254: v58.42,21.7 U2.6
B2  (via drill 0.39)
  Top 0.254: P4.P$4 39.02,24.8 36.83,26.99 v34.61,26.99
  Bottom 0.254: U3.16 24.59,29.87 30.15,29.87 33.03,26.99 v34.61,26.99
EN
  Bottom 0.254: R11.1 15.56,34.61 19.25,30.91 U3.5
FB
  Bottom 0.254: U4.3 40.96,15.56 R20.2 43.18,16.51 43.5,16.83 43.5,18.1 43.81,18.41 R19.1 C9.2
G2  (via drill 0.39)
  Top 0.254: P4.P$3 37.77,20.33 v33.02,25.08
  Bottom 0.254: U3.17 28.69,29.41 v33.02,25.08
GND  (via drill 0.35, 0.55)  (66 unrouted)
  Bottom 0.254: U3.4 22.54,30.41 U3.EP | U3.21 22.79,30.16 U3.EP | U3.6 22.54,31.41 U3.EP
  other vias: 12.06,46.99 1.59,43.5 1.59,41.27 1.59,39.05 1.59,18.1 1.59,15.88 1.59,13.65 62.87,47.94 62.87,45.72 62.87,43.5 62.87,41.27 62.87,39.05 62.87,36.83 62.87,34.61 62.87,32.38 62.87,30.16 30.67,16.51 4.45,43.5 4.45,41.27 4.45,39.05 7.3,43.5 7.3,41.27 7.3,39.05 4.45,18.1 4.45,15.88 4.45,13.65 6.99,18.1 6.99,15.88 6.99,13.65
  pour Bottom: -4.76,60.01 68.26,60.01 68.26,-4.13 -4.76,-4.13
  pour Top: -4.76,60.01 -4.76,-4.13 68.26,-4.13 68.26,60.01
GPIO17
  Bottom 0.254: R2.1 40.96,24.45 40.96,44.45 40.01,45.4 22.02,45.4 21.07,46.35 RPI1.11
GPIO22
  Bottom 0.254: R8.1 43.82,46.67 42.98,47.51 27.1,47.51 26.15,48.47 RPI1.15
GPIO27
  Bottom 0.254: R9.1 42.86,24.45 41.91,25.4 41.91,44.77 40.32,46.35 24.56,46.35 23.61,47.31 RPI1.13
INT
  Bottom 0.254: R10.1 18.1,33.02 18.95,32.16 U3.7
N$1  (via drill 0.35)
  Bottom 0.254: R3.1 v18.41,17.15 SJ1.2
N$2
  Bottom 0.254: K1.1 52.07,23.5 51.12,24.45 R9.2
N$3  (via drill 0.39)
  Top 0.254: v52.07,13.97 v52.07,19.68
  Bottom 0.254: K2.1 v52.07,13.97 | v52.07,19.68 49.21,19.68 47.31,21.59 R2.2
N$4  (via drill 0.39)
  Top 0.254: v19.37,24.13 v19.37,27.62
  Bottom 0.254: C5.2 13.02,24.77 13.65,24.13 v19.37,24.13 | v19.37,27.62 19.91,28.16 U3.24
N$5
  Bottom 0.254: C4.2 20.96,26.36 21.79,27.19 U3.23
N$6
  Bottom 0.254: C4.1 16.21,28.91 U3.1
N$7
  Bottom 0.254: SJ2.2 13.34,17.15 R1.1
N$9
  Bottom 0.254: R8.2 48.26,29.84 50.8,29.84 52.07,31.11 K3.1
N$11
  Bottom 0.254: C5.1 13.02,29.53 13.34,29.84 17.78,29.84 18.21,29.41 U3.2
N$13
  Bottom 0.254: U5.1 38.67,31.49 R15.1
N$15
  Bottom 0.254: L1.2 37.78,21.27 38.73,20.32 38.73,17.78 | 38.73,17.78 D1.A | U4.1 38.42,17.46 38.73,17.78
N$16
  Bottom 0.254: U4.5 32.7,16.51 33.34,15.88 33.34,14.92 33.97,14.29 34.92,14.29 35.24,13.97 R18.2 36.19,11.43 40.33,11.43 R17.1
N$17
  Bottom 0.254: R21.1 38.73,34.92 38.1,34.29 34.92,34.29 34.31,34.9 U5.17
OUT0  (via drill 0.39)
  Top 0.254: v33.02,28.26 40.96,28.26 42.87,26.34 P1.P$1
  Bottom 0.254: U5.6 v33.01,28.27 v33.02,28.26
R1  (via drill 0.39)
  Top 0.254: P3.P$2 31.42,23.19 27.62,26.99 27.62,30.8 v26.99,31.43
  Bottom 0.254: U3.13 26.97,31.41 v26.99,31.43
R2  (via drill 0.39)
  Top 0.254: v28.57,32.07 28.57,27.23 36.52,19.28 P4.P$2
  Bottom 0.254: U3.12 28.48,32.16 v28.57,32.07
R3  (via drill 0.39)
  Top 0.254: P2.P$2 26.34,13.35 22.23,17.46 22.23,31.75 23.81,33.34 v24.77,33.34
  Bottom 0.254: v24.77,33.34 23.81,33.34 23.29,32.82 U3.11
SCL  (via drill 0.35, 0.39)
  Top 0.254: v13.45,42.43 12.27,42.43 v10.48,40.64 | P6.P$2 17.79,8.24 | 17.79,8.24 16.19,9.84 v10.17,9.84 | 17.79,8.24 20.31,8.24 v20.32,8.26
  Bottom 0.254: U3.9 22.29,37.08 19.37,40.01 | 19.37,40.01 15.88,40.01 v13.45,42.43 RPI1.5 | P7.P$2 v10.17,9.84 9.54,10.48 9.54,39.7 v10.48,40.64 | 19.37,40.01 33.97,40.01 34.96,39.02 U5.18 | v20.32,8.26 20.32,11.43 18.54,13.21 SJ1.1
SDA  (via drill 0.39)
  Top 0.254: v16.19,40.73 15.14,39.69 v13.97,39.69
  Bottom 0.254: RPI1.3 10.91,42.75 12.7,40.96 | U3.8 21.79,36.63 19.37,39.05 14.61,39.05 v13.97,39.69 12.7,40.96 | P7.P$3 11.42,11.43 | 12.7,40.96 10.47,38.73 10.47,11.76 10.79,11.43 11.42,11.43 | P6.P$3 19.04,10.8 18.41,11.43 13.34,11.43 | 13.34,11.43 11.42,11.43 | U5.19 35.61,39.32 34.2,40.73 v16.19,40.73 | SJ2.1 13.34,11.43
TRIG
  Bottom 0.254: R12.2 23.81,34.29 22.79,33.27 U3.10
VLED
  Bottom 0.254: 45.09,11.75 R19.2 C9.1 | 45.09,11.75 45.09,7.62 | 45.09,7.62 45.09,3.82 P1.P$2 | C10.1 44.77,7.94 45.09,7.62 | 45.09,11.75 44.45,12.38 R17.2 43.18,13.34 43.01,13.51 D1.K
VOUT
  Bottom 0.254: U3.22 22.29,26.6 23.18,25.72 C1.1

### Text on the board
Top: Kursk / V1.0 / TOVIDERO
tNames: C | A | C | A | C | A | A | A | C | A | 12V | GND | 5VE | FL1 | FL2 | FL3 | GND | P2 | Temp | Pressure | R3 | R1 | R2 | G2 | B2 | UV | UV-VIS
bNames: U2 | P7 | P6 | P3 | P4 | P1 | P5